# EAGLE design LED_MatrixB (EAGLE 5.11)
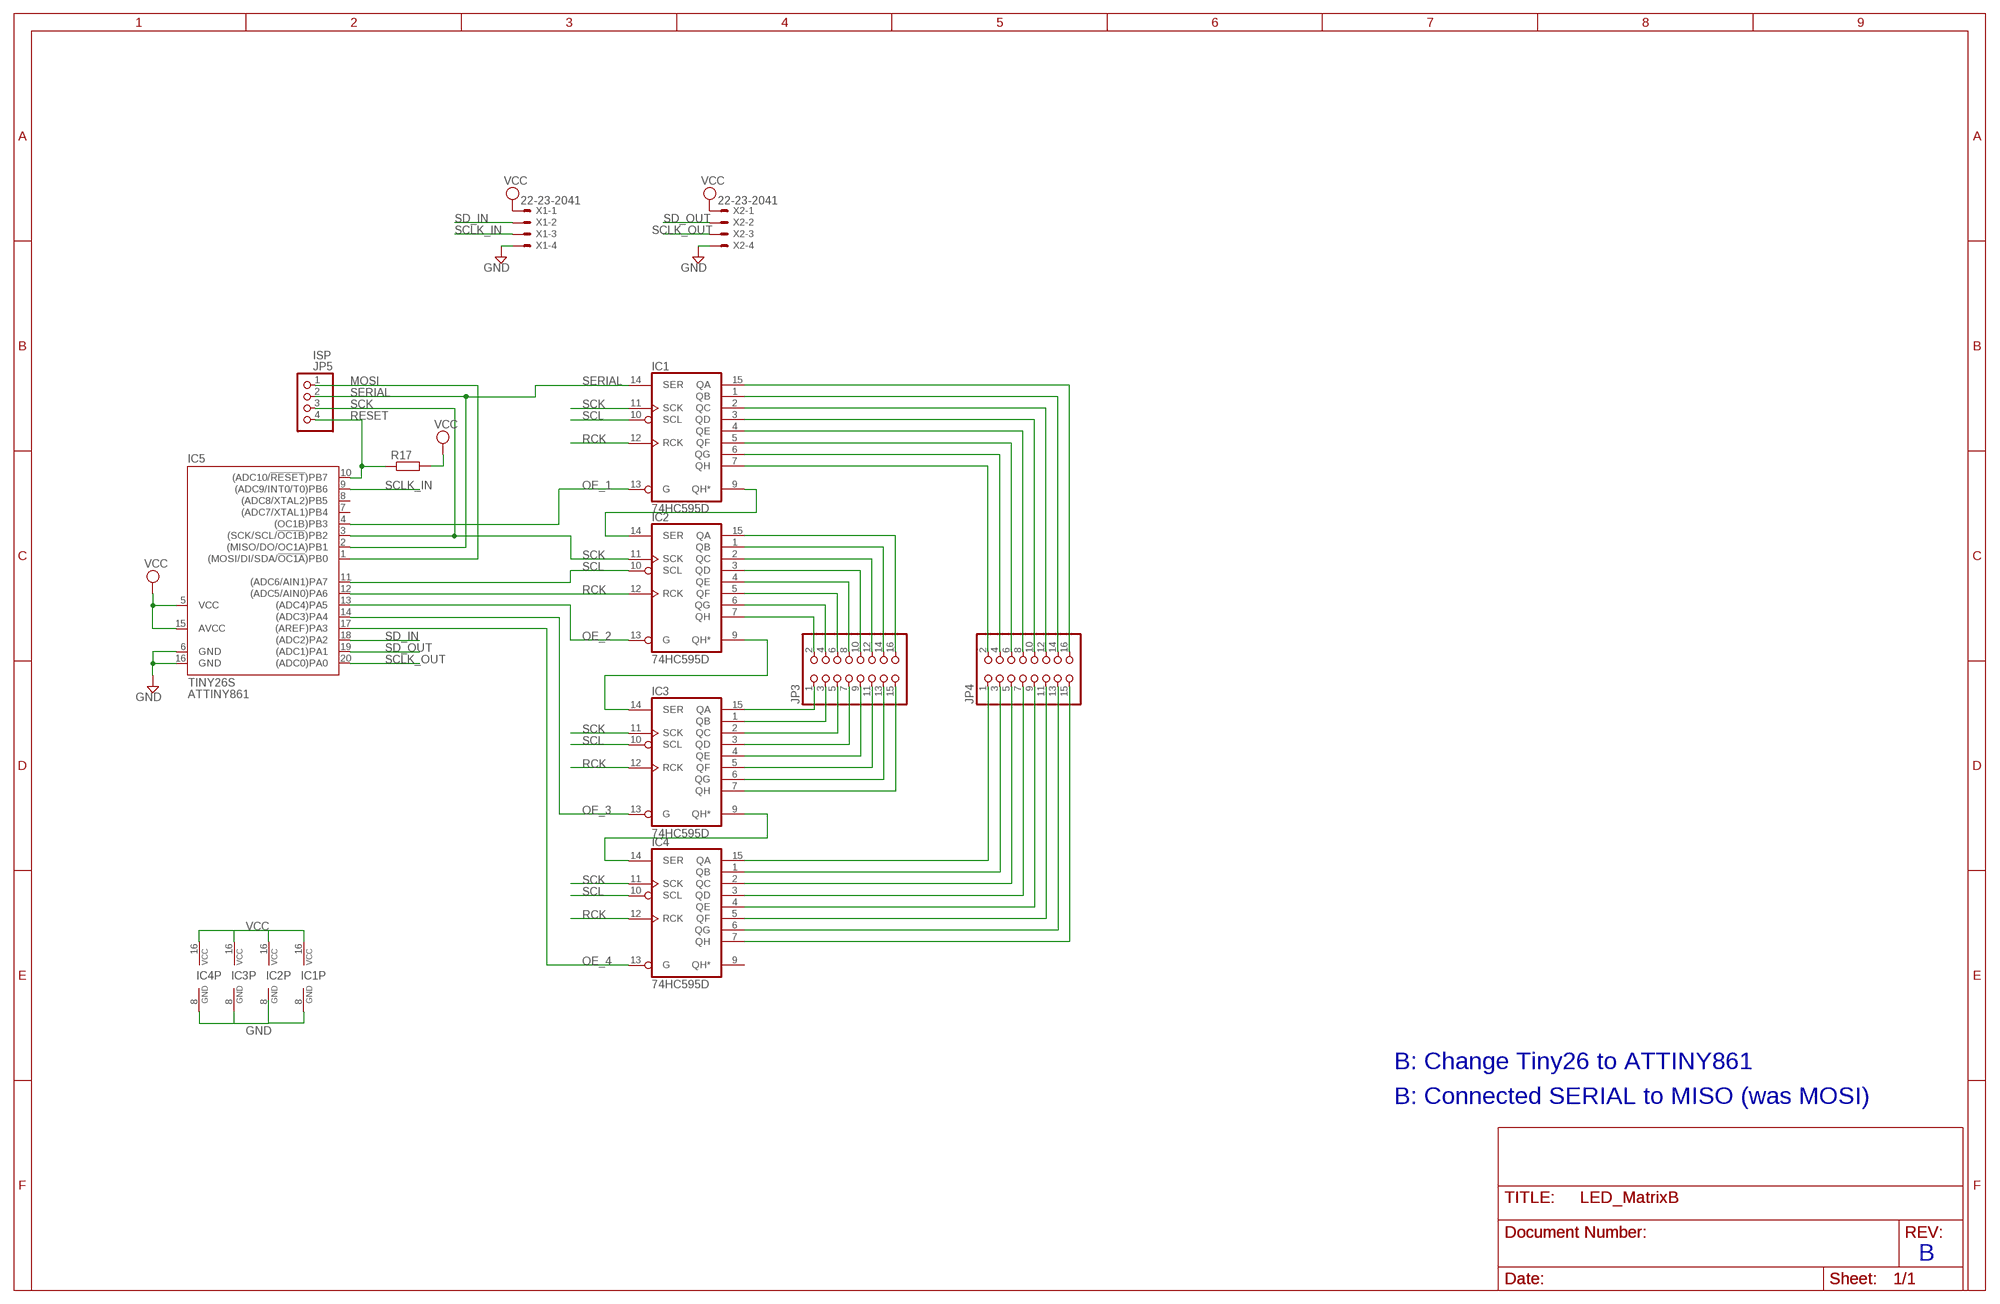
[diagram p0: schematic, sheet 1]

## Parts
IC1  74HC595D  [SO16]
IC2  74HC595D  [SO16]
IC3  74HC595D  [SO16]
IC4  74HC595D  [SO16]
IC5  TINY26S  [SO20L]
JP3  PINHD-2X8  [2X08]
JP4  PINHD-2X8  [2X08]
JP5  PINHD-1X4  [1X04]
R17  R-EU_R0805  [R0805]
X1  22-23-2041  [22-23-2041]
X2  22-23-2041  [22-23-2041]

## Nets
GND: IC1.8(GND) IC3.8(GND) IC4.8(GND) IC5.6(GND) IC5.16(GND) X1.4 X2.4
MOSI: IC5.1((MOSI/DI/SDA/!OC1A!)PB0) JP5.1
N$2: IC3.15(QA) JP3.1
N$4: IC3.1(QB) JP3.3
N$8: IC3.2(QC) JP3.5
N$33: IC3.3(QD) JP3.7
N$34: IC3.4(QE) JP3.9
N$35: IC3.5(QF) JP3.11
N$36: IC3.6(QG) JP3.13
N$37: IC3.7(QH) JP3.15
N$38: IC2.7(QH) JP3.2
N$39: IC2.6(QG) JP3.4
N$40: IC2.5(QF) JP3.6
N$41: IC4.15(QA) JP4.1
N$42: IC4.1(QB) JP4.3
N$43: IC4.2(QC) JP4.5
N$44: IC4.3(QD) JP4.7
N$45: IC4.4(QE) JP4.9
N$46: IC4.5(QF) JP4.11
N$47: IC4.6(QG) JP4.13
N$48: IC4.7(QH) JP4.15
N$49: IC3.9(QH*) IC4.14(SER)
N$50: IC2.9(QH*) IC3.14(SER)
N$51: IC1.9(QH*) IC2.14(SER)
N$69: IC2.4(QE) JP3.8
N$71: IC2.3(QD) JP3.10
N$75: IC2.2(QC) JP3.12
N$76: IC2.1(QB) JP3.14
N$77: IC2.15(QA) JP3.16
N$78: IC1.7(QH) JP4.2
N$79: IC1.6(QG) JP4.4
N$80: IC1.5(QF) JP4.6
N$81: IC1.4(QE) JP4.8
N$82: IC1.3(QD) JP4.10
N$83: IC1.2(QC) JP4.12
N$84: IC1.1(QB) JP4.14
N$85: IC1.15(QA) JP4.16
OE_1: IC1.13(G) IC5.4((OC1B)PB3)
OE_2: IC2.13(G) IC5.13((ADC4)PA5)
OE_3: IC3.13(G) IC5.14((ADC3)PA4)
OE_4: IC4.13(G) IC5.17((AREF)PA3)
RCK: IC1.12(RCK) IC2.12(RCK) IC3.12(RCK) IC4.12(RCK) IC5.12((ADC5/AIN0)PA6)
RESET: IC5.10((ADC10/!RESET!)PB7) JP5.4 R17.1
SCK: IC1.11(SCK) IC2.11(SCK) IC3.11(SCK) IC4.11(SCK) IC5.3((SCK/SCL/!OC1B!)PB2) JP5.3
SCL: IC1.10(SCL) IC2.10(SCL) IC3.10(SCL) IC4.10(SCL) IC5.11((ADC6/AIN1)PA7)
SCLK_IN: IC5.9((ADC9/INT0/T0)PB6) X1.3
SCLK_OUT: IC5.20((ADC0)PA0) X2.3
SD_IN: IC5.18((ADC2)PA2) X1.2
SD_OUT: IC5.19((ADC1)PA1) X2.2
SERIAL: IC1.14(SER) IC5.2((MISO/DO/OC1A)PB1) JP5.2
VCC: IC1.16(VCC) IC2.16(VCC) IC3.16(VCC) IC4.16(VCC) IC5.5(VCC) IC5.15(AVCC) R17.2 X1.1 X2.1
Unconnected: IC4.9(QH*) IC5.7((ADC7/XTAL1)PB4) IC5.8((ADC8/XTAL2)PB5)

## Notes on the sheet
- ISP
- ATTINY861
- B: Change Tiny26 to ATTINY861
- B: Connected SERIAL to MISO (was MOSI)
- B

## Power pins joined to a net without a drawn wire
GND: IC2.8(GND)

## Library data of the parts
IC1-IC4 = 74xx-eu:74*595: 8-bit SHIFT REGISTER, output latch
IC5 = atmel:TINY26*: 8-bit AVR Microcontroller with 2K Bytes Flash Source: http://www.atmel.com .. doc1477.pdf
JP3 JP4 = pinhead:PINHD-2X8: PIN HEADER
JP5 = pinhead:PINHD-1X4: PIN HEADER
R17 = rcl:R-EU_: RESISTOR, European symbol
X1 X2 = con-molex:22-23-2041: .100" (2.54mm) Center Header - 4 Pin

## Board
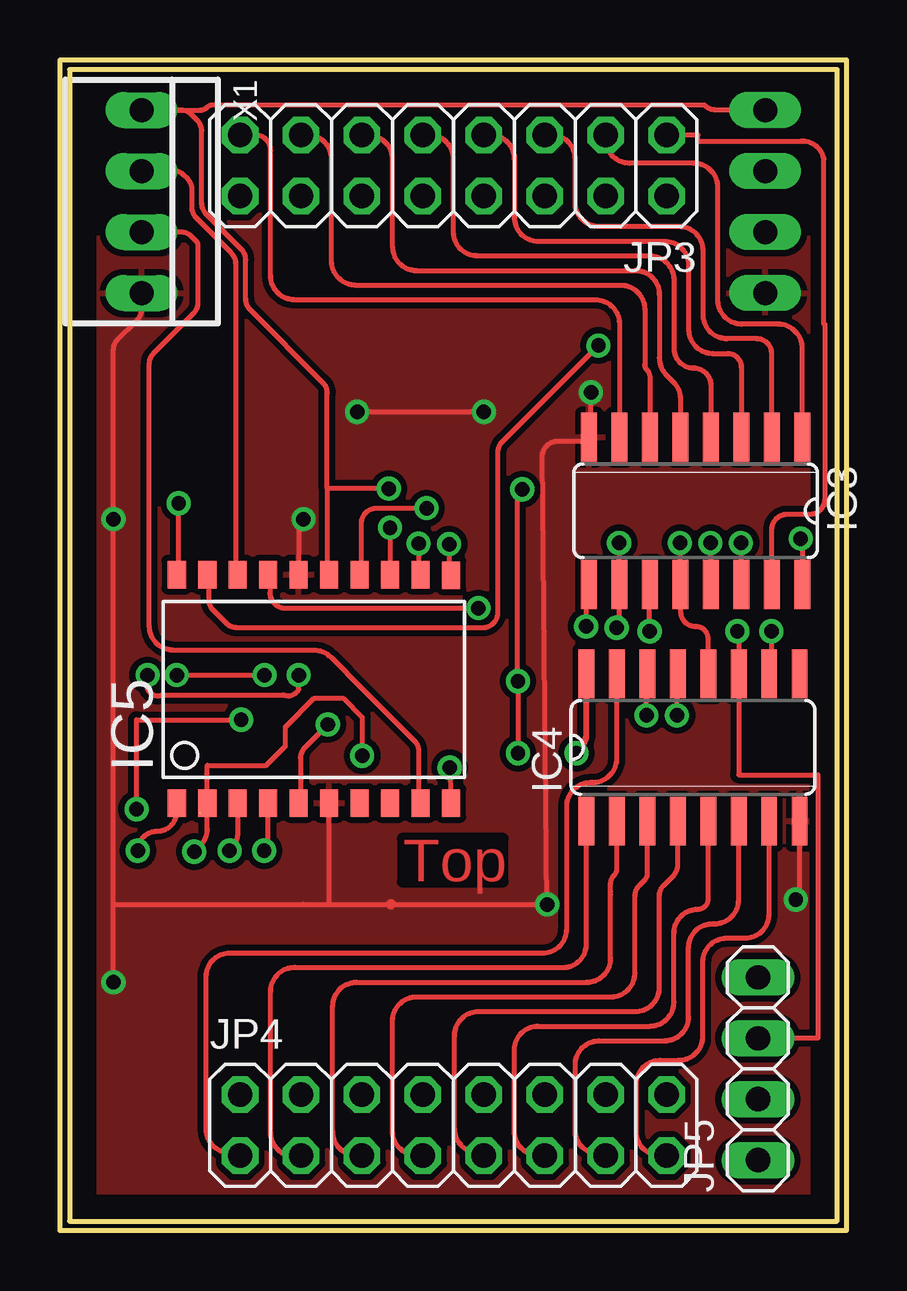
[diagram p1: board, top side]
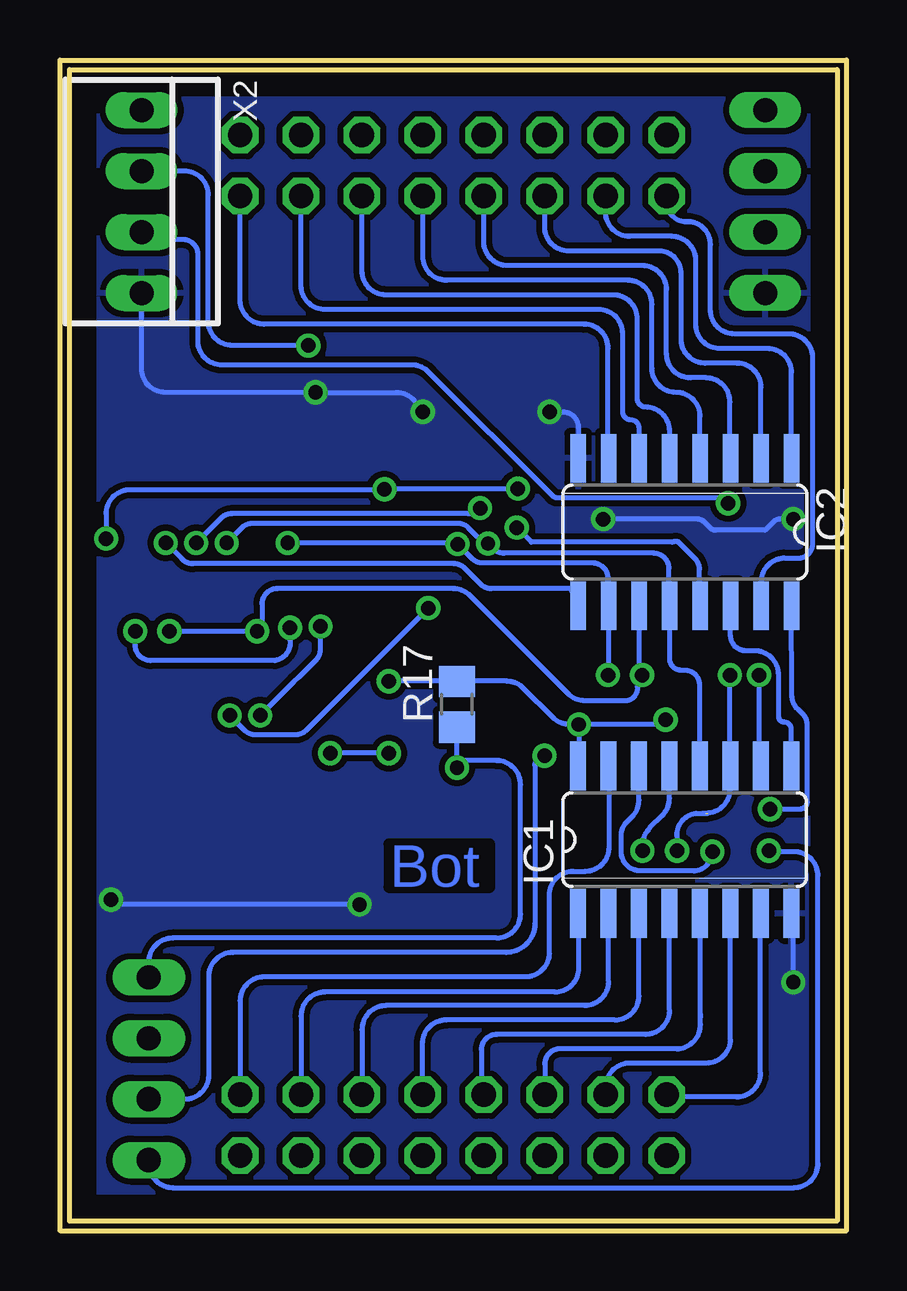
[diagram p2: board, bottom side, seen from below]

Size 32.8 x 48.8 mm. Coordinates in mm from the lower left corner, seen from the top.
Outline: 32.8,0 32.8,48.8 0,48.8 0,0 32.8,0
Outline: 0.4,0.4 32.4,0.4 32.4,48.4 0.4,48.4 0.4,0.4
Copper layers (1*16): Top 0.035mm / dielectric 1.5mm / Bottom 0.035mm
Design rules "olimex-8mils *": minimum track width 8mil, minimum drill 0.6mm, track to track 10mil, track to pad 10mil, pad to pad 8mil, via to via 8mil, smd to smd 8mil, copper to edge 40mil, drill to drill 10mil, minimum pad ring 10mil, minimum via ring 8mil, stop-mask expansion 0mil, vias tented up to drill 0mil, thermal gap 10mil

### Footprints (pad centres in the part's own frame; a part is rotated, then mirrored left to right if it is on the bottom)
SO16 = smd 0.66 x 2.032: 1 -4.445,-3.073; 2 -3.175,-3.073; 3 -1.905,-3.073; 4 -0.635,-3.073; 5 0.635,-3.073; 6 1.905,-3.073; 7 3.175,-3.073; 8 4.445,-3.073; 9 4.445,3.073; 10 3.175,3.073; 11 1.905,3.073; 12 0.635,3.073; 13 -0.635,3.073; 14 -1.905,3.073; 15 -3.175,3.073; 16 -4.445,3.073
SO20L = smd 0.762 x 1.143: 1 -5.08,-5.131; 2 -3.81,-5.131; 3 -2.54,-5.131; 4 -1.27,-5.131; 5 0,-5.131; 6 1.27,-5.131; 7 2.54,-5.131; 8 3.81,-5.131; 9 5.08,-5.131; 10 6.35,-5.131; 11 6.35,4.369; 12 5.08,4.394; 13 3.81,4.394; 14 2.54,4.394; 15 1.27,4.394; 16 0,4.394; 17 -1.27,4.394; 18 -2.54,4.394; 19 -3.81,4.394; 20 -5.08,4.394
2X08 = drill 1.016 octagon: 1 -8.89,-1.27; 2 -8.89,1.27; 3 -6.35,-1.27; 4 -6.35,1.27; 5 -3.81,-1.27; 6 -3.81,1.27; 7 -1.27,-1.27; 8 -1.27,1.27; 9 1.27,-1.27; 10 1.27,1.27; 11 3.81,-1.27; 12 3.81,1.27; 13 6.35,-1.27; 14 6.35,1.27; 15 8.89,-1.27; 16 8.89,1.27
1X04 = drill 1.016 long: 1 -3.81,0; 2 -1.27,0; 3 1.27,0; 4 3.81,0
R0805 = smd 1.3 x 1.5: 1 -0.95,0; 2 0.95,0
22-23-2041 = drill 1 long: 1 -3.81,0; 2 -1.27,0; 3 1.27,0; 4 3.81,0

### Placement (x,y rotation side)
IC1  6.76,16.3 0 bottom
IC2  6.75,29.12 180 bottom
IC3  26.5,30.01 180 top
IC4  26.39,20.15 0 top
IC5  9.95,22.96 0 top
JP3  16.4,44.4 180 top
JP4  16.4,4.4 0 top
JP5  29.1,6.75 90 top
R17  16.25,21.94 90 bottom
X1  3.4,42.9 270 top
X2  29.4,42.9 270 bottom

### Tracks (layer width: path | path; a pad name or v marks a point on that pad's centre or on a via)
GND  (via drill 0.6)
  Top 0.203: 22.06,32.91 IC3.8 | v22.14,34.94 22.14,32.91 22.06,32.91 | X1.4 3.4,38.41 arc-45 3.21,37.96 2.41,37.16 arc44 2.23,36.72 v2.23,29.66 | 2.23,13.61 v2.23,29.66 | v2.23,10.36 2.23,13.61 | IC5.6 11.22,13.61 10.15,13.61 | 2.23,13.61 10.15,13.61 | 10.15,13.61 13.81,13.61 | v20.31,13.6 20.11,32.28 arc-90 20.74,32.91 22.06,32.91 | v17.67,34.13 v12.39,34.13 | IC5.16 9.95,29.66 v10.15,29.66 | 13.8,13.6 v20.31,13.6 | IC4.8 30.83,14.18 arc-45 v30.68,13.8
  Top 0.406: 13.81,13.61 13.81,13.61 arc90 13.8,13.6 | v20.31,13.6 arc-90 v20.31,13.6
  Bottom 0.203: 28.4,34.94 arc90 29.4,35.94 X2.4 | 2.31,13.2 2.43,13.2 | 2.31,13.2 IC1.8 | v2.23,10.36 2.23,13.2 2.31,13.2 | v12.39,34.13 11.83,34.13 arc90 11.19,33.5 IC2.8 | v17.67,34.13 17.98,34.54 arc-53 18.78,34.94 v22.14,34.94 28.4,34.94 | v2.23,29.66 2.81,29.66 arc-45 3.03,29.57 3.4,29.2 5.47,29.2 arc45 5.69,29.29 6,29.6 5.8,29.4 5.97,29.57 arc-45 6.19,29.66 v10.15,29.66 | 28.4,34.94 28.44,34.94 | v20.31,13.6 30.47,13.6 arc90 v30.68,13.8
  pour Top: -2,54.2 -2,-1.8 44.6,-1.8 44.6,54.4 -2,54.4
  pour Bottom: -7.8,50.4 -7.8,-5.6 34.8,-5.6 34.8,50.4
MOSI  (via drill 0.6)
  Top 0.203: v3.25,15.84 arc-90 4.06,16.66 arc91 4.87,17.48 IC5.1
  Bottom 0.203: v3.25,15.84 3.2,15.84 3.2,15.8 2.2,15.8 arc90 1.2,14.8 1.2,2.8 arc90 2.2,1.8 28.1,1.8 arc90 29.1,2.8 JP5.1
N$2
  Top 0.203: JP3.1 26.6,45.67 26.6,45.4 30.8,45.4 arc-90 31.84,44.67 31.84,37.79 31.9,37.79 31.9,30.5 arc-90 31.26,29.86 30.31,29.86 arc90 29.68,29.23 IC3.15
N$4
  Top 0.203: IC3.1 30.95,36.79 arc90 29.95,37.79 28.43,37.79 arc-90 27.43,38.79 27.43,43.49 arc90 26.43,44.49 23.75,44.49 arc-90 22.75,45.49 JP3.3
N$8
  Top 0.203: JP3.5 20.48,45.67 arc-90 21.48,44.67 21.48,42.85 arc90 22.48,41.85 25.82,41.85 arc-90 26.82,40.85 26.82,38.18 arc90 27.82,37.18 29.05,37.18 arc-90 29.68,36.55 IC3.2
N$33
  Top 0.203: JP3.7 17.94,45.67 arc-90 18.94,44.67 18.94,42.24 arc90 19.94,41.24 25.21,41.24 arc-90 26.21,40.24 26.21,37.57 arc90 27.21,36.57 27.83,36.57 arc-90 28.41,36 IC3.3
N$34
  Top 0.203: JP3.9 15.4,45.67 arc-90 16.4,44.67 16.4,41.63 arc90 17.4,40.63 24.6,40.63 arc-90 25.6,39.63 25.6,36.77 arc90 26.41,35.96 arc-90 27.14,35.23 IC3.4
N$35
  Top 0.203: JP3.11 12.59,45.71 | JP3.11 | JP3.11 12.86,45.66 arc-90 13.86,44.66 13.86,41.02 arc90 14.86,40.02 23.99,40.02 arc-90 24.99,39.02 24.99,36.37 arc45 25.28,35.67 25.57,35.37 arc-45 25.87,34.67 IC3.5
N$36
  Top 0.203: JP3.13 10.32,45.67 arc-90 11.32,44.67 11.32,40.41 arc90 12.32,39.41 23.38,39.41 arc-90 24.38,38.41 24.38,36.1 arc45 24.48,35.86 arc-45 24.6,35.58 IC3.6
N$37
  Top 0.203: JP3.15 8.15,45.67 arc-90 8.78,45.03 8.78,39.8 arc90 9.78,38.8 16.25,38.8 | 16.25,38.8 18.48,38.8 | 16.25,38.8 22.33,38.8 arc-90 23.33,37.8 IC3.7
N$38
  Bottom 0.203: JP3.2 25.29,38.79 arc-90 24.29,37.79 10.95,37.79 arc90 9.95,36.79 9.95,32.2 IC2.7
N$39
  Bottom 0.203: JP3.4 22.75,39.4 arc-90 21.75,38.4 10.34,38.4 arc90 9.34,37.4 9.34,34.14 arc-90 9,33.8 arc90 8.65,33.45 IC2.6
N$40
  Bottom 0.203: IC2.5 7.38,33.33 arc-90 8.38,34.33 arc90 8.73,34.68 8.73,38.01 arc-90 9.73,39.01 19.21,39.01 arc90 20.21,40.01 JP3.6
N$41
  Top 0.203: 7.51,3.25 | JP4.1 7.51,3.25 | 7.51,3.25 7.09,3.25 arc-90 6.09,4.25 6.09,10.58 arc-90 7.09,11.58 20.13,11.58 arc90 21.13,12.58 21.13,17.69 arc-90 22.13,18.69 22.21,18.69 arc90 23.21,19.69 IC4.15
N$42
  Top 0.203: IC4.1 21.94,14.01 21.95,14.01 21.94,11.96 arc-94 20.94,10.97 9.78,10.98 arc90 8.78,9.98 8.78,4.09 arc90 9.78,3.09 10.05,3.09 JP4.3
N$43
  Top 0.203: JP4.5 12.37,3.13 arc-90 11.37,4.13 11.37,9.36 arc-90 12.37,10.36 21.95,10.36 arc90 22.95,11.36 22.95,14.01 | 22.95,14.01 22.95,14.13 | IC4.2 23.21,15.09 arc-45 23.11,14.83 arc45 22.95,14.46 22.95,14.01
N$44
  Top 0.203: 15.13,3.14 | JP4.7 15.13,3.14 | 15.13,3.14 14.86,3.14 arc-90 13.86,4.14 13.86,8.75 arc-90 14.86,9.75 22.95,9.75 22.97,9.75 arc90 23.97,10.75 23.97,13.96 arc-45 24.16,14.4 24.38,14.62 arc45 24.48,14.88 IC4.3
N$45
  Top 0.203: JP4.9 17.67,3.04 | JP4.9 | 24.99,13.41 24.99,10.14 arc-90 23.99,9.14 17.45,9.14 arc90 16.45,8.14 16.45,4.25 arc90 17.45,3.25 17.67,3.25 JP4.9 | 24.99,13.41 24.99,13.45 | IC4.4 25.75,15.25 arc-45 25.57,14.8 25.17,14.4 arc45 24.99,13.96 24.99,13.41
N$46
  Top 0.203: 20.21,3.14 | JP4.11 20.21,3.14 | 20.21,3.14 19.94,3.14 arc-90 18.94,4.14 18.94,7.53 arc-90 19.94,8.53 24.6,8.53 arc90 25.6,9.53 25.6,12.4 arc-90 26.6,13.4 arc90 27.02,13.83 IC4.5
N$47
  Top 0.203: 22.8,3.19 22.8,3.13 JP4.13 | 22.8,3.19 22.48,3.19 arc-90 21.48,4.19 21.48,6.92 arc-90 22.48,7.92 25.21,7.92 arc90 26.21,8.92 26.21,11.79 arc-90 27.21,12.79 27.29,12.79 arc90 28.29,13.79 IC4.6 | 22.8,3.19 22.8,3.2
N$48
  Top 0.203: JP4.15 25.02,3.13 arc-90 24.02,4.13 24.02,6.11 arc-90 25.02,7.11 25.8,7.11 arc90 26.8,8.11 26.8,11.2 arc-90 27.8,12.2 28.56,12.2 arc90 29.56,13.2 IC4.7
N$49  (via drill 0.6)
  Top 0.203: v24.45,21.48 24.45,22.22 IC4.14 | v21.94,25.19 21.94,25.93 IC3.9
  Bottom 0.203: v24.45,21.48 23.06,22.88 22.83,23.08 22.12,23.79 arc-45 21.94,24.23 v21.94,25.19
N$50  (via drill 0.6)
  Top 0.203: v28.39,28.67 28.39,27.93 IC3.14
  Bottom 0.203: v28.39,28.67 27.71,27.99 arc-45 27.26,27.81 16.39,27.81 arc45 15.94,27.62 15.27,26.95 arc-45 14.82,26.76 11.5,26.76 IC2.9
N$51
  Bottom 0.203: IC2.14 4.84,24.81 arc-90 4.21,24.17 3.84,24.17 arc90 2.84,23.17 2.84,21.44 arc-90 2.6,21.2 arc90 2.31,20.91 IC1.9
N$69
  Bottom 0.203: IC2.4 6.11,33.94 arc-90 7.11,34.94 7.12,34.94 arc90 8.12,35.94 8.12,38.62 arc-90 9.12,39.62 16.67,39.62 arc90 17.67,40.62 JP3.8
N$71
  Bottom 0.203: 4.84,32.3 4.67,32.3 | IC2.3 4.84,32.3 | 4.84,32.3 4.87,32.3 4.87,34.55 arc-90 5.87,35.55 6.51,35.55 arc90 7.51,36.55 7.51,39.23 arc-90 8.51,40.23 14.13,40.23 arc90 15.13,41.23 JP3.10
N$75
  Bottom 0.203: IC2.2 3.57,35.16 arc-90 4.57,36.16 5.9,36.16 arc86 6.9,37.1 6.9,39.9 arc-94 7.9,40.84 11.59,40.84 arc90 12.59,41.84 JP3.12
N$76
  Bottom 0.203: JP3.14 10.05,42.45 arc-90 9.05,41.45 7.29,41.45 arc90 6.29,40.45 6.29,37.77 arc-90 5.29,36.77 3.3,36.77 arc90 2.3,35.77 IC2.1
N$77
  Bottom 0.203: JP3.16 7.51,42.88 arc-90 6.68,42.06 arc94 5.68,41.12 5.68,38.32 arc-86 4.68,37.38 2.42,37.38 arc90 1.42,36.38 1.42,28.64 arc90 2.03,28.04 2.57,28.04 arc-90 3.57,27.04 IC2.15
N$78
  Bottom 0.203: JP4.2 7.51,5.57 4.6,5.57 arc-90 3.6,6.57 3.6,13.2 3.58,13.2 IC1.7
N$79
  Bottom 0.203: IC1.6 4.85,7.98 arc90 5.85,6.98 9.05,6.98 arc-90 10.05,5.98 JP4.4
N$80
  Bottom 0.203: IC1.5 arc90 6.1,13.2 6.1,9 | 6.1,9 6.1,8.9 | JP4.6 12.59,6.95 arc90 11.96,7.58 7.1,7.58 arc-90 6.1,8.58 6.1,9
N$81
  Bottom 0.203: 15.1,5.67 JP4.8 15.23,5.67 15.23,7.55 arc90 14.6,8.18 8.39,8.18 arc-90 7.39,9.18 IC1.4
N$82
  Bottom 0.203: JP4.10 17.7,5.67 17.7,7.78 arc90 16.7,8.78 9.66,8.78 arc-90 8.66,9.78 IC1.3
N$83
  Bottom 0.203: IC1.2 9.93,10.38 arc90 10.93,9.38 19.21,9.38 arc-90 20.21,8.38 JP4.12
N$84
  Bottom 0.203: 11.17,13.23 11.17,13.41 | 11.17,13.23 IC1.1 | JP4.14 22.75,8.95 arc90 21.75,9.95 12.17,9.95 arc-90 11.17,10.95 11.17,13.23
N$85
  Bottom 0.203: JP4.16 25.29,9.58 arc90 24.29,10.58 13.4,10.58 arc-90 12.4,11.58 12.4,13.99 arc90 11.4,14.99 10.9,14.99 arc-90 9.9,15.99 9.9,19.37 | 9.9,19.37 9.9,19.4 | 9.9,19.37 IC1.15
OE_1  (via drill 0.6)
  Top 0.203: IC5.4 8.68,16.25 arc-45 v8.51,15.84
  Bottom 0.203: IC1.13 7.39,18.02 arc45 7.69,17.31 8.22,16.78 arc-45 8.51,16.07 v8.51,15.84
OE_2  (via drill 0.6)
  Top 0.203: v13.76,29.3 IC5.13
  Bottom 0.203: v13.76,29.3 13.15,28.7 7.27,28.7 arc45 7.02,28.71 6.33,28.02 arc45 6.14,27.57 6.14,27.04 IC2.13
OE_3  (via drill 0.6)
  Top 0.203: v15.28,30.12 13.2,30.12 arc90 12.57,29.48 12.57,27.91 IC5.14 | v27.12,28.67 27.12,27.93 IC3.13
  Bottom 0.203: v15.28,30.12 15.33,30.07 arc45 15.78,29.89 25.64,29.89 arc-45 26.09,29.7 v27.12,28.67
OE_4  (via drill 0.6)
  Top 0.203: v17.44,25.95 10.31,25.95 9.39,25.95 arc-90 8.76,26.59 8.76,26.79 IC5.17 | v25.72,21.48 25.72,22.22 IC4.13
  Bottom 0.203: v17.44,25.95 22.54,20.85 arc45 22.99,20.67 24.65,20.67 arc45 25.1,20.85 v25.72,21.48
RCK  (via drill 0.6)
  Top 0.203: IC4.12 27.02,22.95 | IC4.12 | IC4.12 27.02,24.67 arc90 26.5,25.19 arc-90 25.87,25.82 IC3.12 25.85,27.93 v25.85,28.67 | v14.95,28.64 14.95,27.91 IC5.12
  Bottom 0.203: IC1.12 6.12,22.73 arc-90 6.76,23.36 6.9,23.36 arc90 7.38,23.84 IC2.12 7.41,27.04 7.41,27.6 arc-90 8.04,28.24 14.29,28.24 arc45 14.73,28.42 v14.95,28.64 15.39,28.92 15.76,29.3 arc-45 16.21,29.48 24.77,29.48 arc-45 25.22,29.3 v25.85,28.67
RESET  (via drill 0.6)
  Top 0.203: IC5.10 16.31,18.08 v16.25,19.3
  Bottom 0.203: R17.1 16.2,20.92 16.25,20.92 v16.25,19.3 16,19.3 | 16,19.3 16,19.2 | JP5.4 29.1,11.2 arc90 28.1,12.2 14.6,12.2 arc-90 13.6,13.2 13.6,18.6 arc-90 14.6,19.6 16,19.6 16,19.3
SCK  (via drill 0.6)  (1 unrouted)
  Top 0.203: 7.41,17.67 IC5.3 7.41,16.6 arc-45 7.12,15.89 v7.07,15.84 | v28.24,24.99 28.29,24.99 IC4.11 28.29,19 31.6,19 31.6,8.02 JP5.3 | IC3.11 24.6,27.02 24.58,27.02 v24.58,24.99 | v4.87,23.16 v8.53,23.16
  Bottom 0.203: IC2.11 8.65,23.36 v8.53,23.16 8.73,22.68 8.73,22.52 arc90 9.37,22.09 10.91,22.09 arc45 11.62,22.38 15.7,26.47 arc-45 16.41,26.76 23.74,26.76 arc-90 24.38,26.13 24.38,25.47 v24.58,24.99 v28.24,24.99 | 4.87,19.3 4.85,19.3 IC1.11 | 4.87,19.3 v4.87,23.16 | 6,17.4 5.87,17.4 arc-90 4.87,18.4 4.87,19.3 | v7.07,15.84 7.07,16.4 arc90 6.27,17.4 5.8,17.4
SCL  (via drill 0.6)
  Top 0.203: IC4.10 29.66,23.22 v29.66,24.99 | v23.21,25.14 23.31,24.94 23.31,26.93 IC3.10 23.31,27.93 v23.31,28.67 | v3.65,23.16 3.65,22.57 arc90 4.29,22.34 9.31,22.34 arc90 9.95,22.57 v9.95,23.16 | v16.22,28.62 16.22,27.88 IC5.11
  Bottom 0.203: v23.21,25.14 23.21,24.6 arc90 23.84,23.77 29.03,23.77 arc90 29.66,24.4 v29.66,24.99 | v9.95,23.16 9.92,23.16 IC2.10 9.95,27.04 9.95,27.2 arc-90 10.59,27.83 15.17,27.83 arc45 15.62,28.02 v16.22,28.62 16.71,28.67 v23.31,28.67 | IC1.10 3.58,19.5 3.65,19.5 v3.65,23.16
SCLK_IN
  Top 0.203: IC5.9 14.95,18.38 14.95,20 arc45 14.78,20.42 12.6,22.6 | X1.3 5.03,41.63 arc-45 5.48,41.44 5.68,41.24 arc-45 5.76,41.06 5.76,38.69 arc-45 5.57,38.24 3.91,36.58 arc45 3.73,36.13 3.73,25.2 arc90 4.73,24.2 10.59,24.2 arc-45 11.29,23.91 12.6,22.6 | 12.6,22.6 12.8,22.4
SCLK_OUT  (via drill 0.6)
  Top 0.203: v4.95,30.32 4.95,27.91 IC5.20
  Bottom 0.203: v4.95,30.32 5,30.45 5.05,30.45 arc-45 5.28,30.55 12.05,30.55 arc45 12.28,30.64 17.43,35.79 arc-45 18.14,36.09 26.05,36.09 arc90 27.05,37.09 27.05,38.1 arc90 27.05,38.1 27.04,38.1 27.04,40.68 arc-90 27.68,41.32 28.86,41.32 arc45 29.31,41.5 29.46,41.65 arc-90 29.44,41.63 X2.3
SD_IN
  Top 0.203: IC5.18 7.33,27.91 7.33,40.29 arc45 7.15,40.74 5.69,42.2 arc-45 5.51,42.65 5.51,43.39 arc45 5.32,43.84 5.16,44 arc45 4.71,44.19 3.45,44.19 arc45 X1.2
SD_OUT  (via drill 0.6)
  Top 0.203: v22.45,36.9 18.44,32.89 arc45 18.26,32.45 18.26,25.77 arc-90 17.62,25.14 7.37,25.14 arc-45 6.92,25.33 6.4,25.84 arc-45 6.22,26.29 6.22,26.79 IC5.19
  Bottom 0.203: v22.45,36.9 24.45,36.9 | 24.45,36.9 25.26,36.9 | X2.2 27.61,44.17 arc90 26.61,43.17 26.61,37.9 arc-90 25.61,36.9 24.45,36.9 | 24.45,36.9
SERIAL  (via drill 0.6)
  Top 0.203: v12.6,19.8 12.6,21.4 11.8,22.2 10.6,22.2 9.4,21 9.4,20.2 8.6,19.4 6.14,19.4 IC5.2 6.14,16.75 arc-45 5.85,16.05 v5.6,15.8
  Bottom 0.203: JP5.2 27.6,5.48 arc-90 26.6,6.48 26.6,10.6 arc90 25.6,11.6 14.2,11.6 arc-90 13,12.8 13,19.4 arc90 v12.6,19.8 | v5.6,15.8 arc90 6.4,15 8.6,15 arc90 9.4,15.8 9.4,16.52 arc45 9.2,17 8.96,17.24 arc-45 8.66,17.95 IC1.14
VCC  (via drill 0.6)
  Top 0.203: v11.17,21.1 10.21,20.14 arc45 10.03,19.7 10.03,18.38 IC5.5 | 11.14,30.93 11.14,27.91 IC5.15 | 11.14,30.93 11.14,34.91 arc45 10.96,35.36 7.93,38.39 arc-45 7.74,38.84 7.74,40.47 arc45 7.56,40.92 6.1,42.38 arc-45 5.91,42.83 5.91,45.83 arc45 5.73,46.28 5.48,46.52 arc45 5.03,46.71 X1.1 5.85,46.71 arc45 6.14,46.83 arc-45 6.39,46.93 26.79,46.93 arc-45 26.92,46.88 arc45 27.29,46.73 29.46,46.73 X2.1 | v13.71,30.93 11.14,30.93 | IC3.16 30.95,28.85 v30.88,28.85 | v19.09,19.91 v19.09,22.9 19.12,22.98 19.07,22.93 19.07,30.39 arc-45 19.25,30.84 19.3,30.88 arc-90 v19.27,30.9 | v3.19,17.57 3.19,21.3 v7.55,21.3
  Top 0.254: v21.53,19.91 21.65,20.03 arc45 21.95,20.73 IC4.16
  Bottom 0.203: v11.17,21.1 11.17,20.36 IC1.16 | v19.09,22.9 16.93,22.9 R17.2 16.25,22.9 14.18,22.9 arc45 13.47,22.61 12.25,21.39 arc-45 11.54,21.1 v11.17,21.1 | v13.71,30.93 18.84,30.93 v19.27,30.9 19.47,30.88 29.88,30.88 arc-90 30.88,29.88 v30.88,28.85 | v19.09,19.91 v21.53,19.91 | IC2.16 2.28,22.27 arc-51 2.03,21.74 1.83,21.54 arc45 1.65,21.09 1.65,17.89 arc90 1.96,17.57 v3.19,17.57 | v11.17,21.1 7.75,21.1 v7.55,21.3

### Text on the board
Top: Top
Bottom: Bot